# EasyEDA schematic SCH_OpenRICE.json
TITLE: CH32X033F8P6; REV: 1.0; Date: 2026-05-31; Sheet: 1/1; Drawn By: Saandeep; Company: Vishishta Innovators
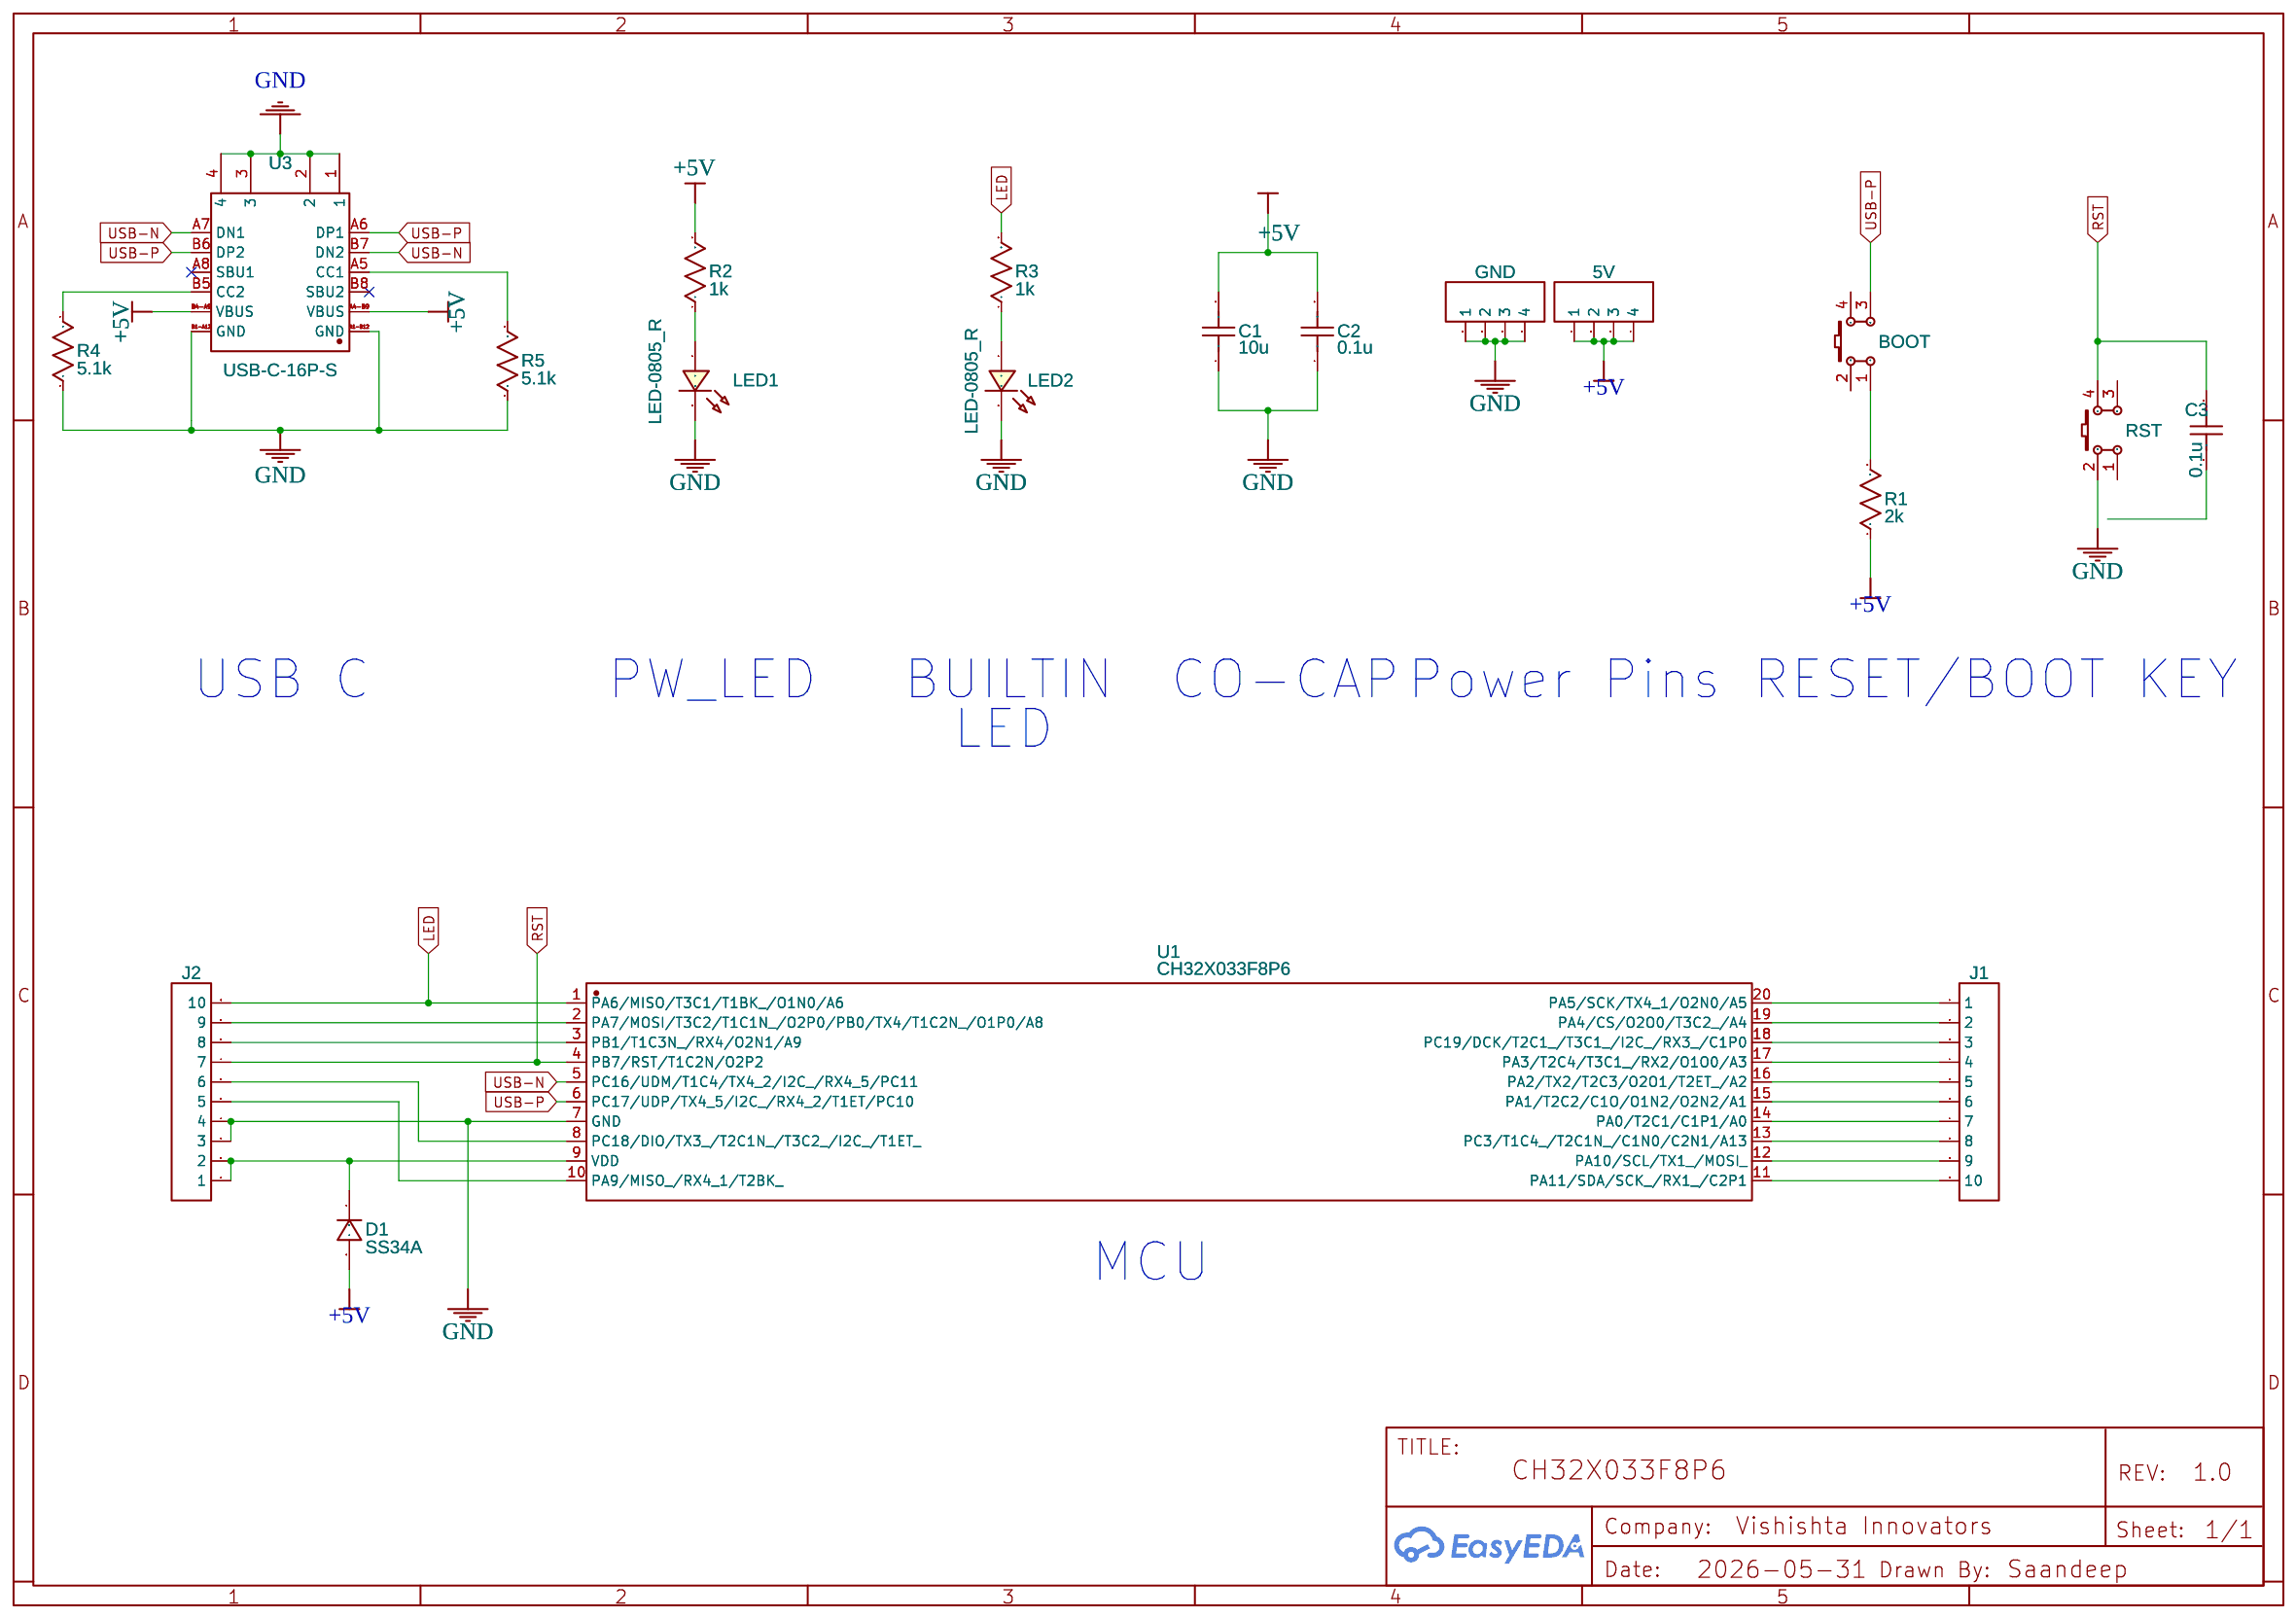
[diagram p0: schematic sheet]

## Parts
5V  HDR-M-2.54_1x4  [HDR-M-2.54_1X4]
BOOT  K4-6×6_TH  [KEY-TH_4P-L6.0-W6.0-P4.50-LS6.5]
C1  10u  [C0805]
C2  0.1u  [C0805]
C3  0.1u  [C0805]
D1  SS34A  [SMA_L4.3-W2.6-LS5.2-RD]
GND  HDR-M-2.54_1x4  [HDR-M-2.54_1X4]
J1  HDR-M-2.54_1x10  [HDR-M-2.54_1X10]
J2  HDR-M-2.54_1x10  [HDR-M-2.54_1X10]
LED1  LED-0805_R  [LED0805_RED]
LED2  LED-0805_R  [LED0805_RED]
R1  2k  [R0805]
R2  1k  [R0805]
R3  1k  [R0805]
R4  5.1k  [R0805]
R5  5.1k  [R0805]
RST  K4-6×6_TH  [KEY-TH_4P-L6.0-W6.0-P4.50-LS6.5]
U1  CH32X033F8P6  [TSSOP-20_L6.5-W4.4-P0.65-LS6.4-BL]
U3  USB-C-16P-S  [USB-C-16P-S]

## Library data of the parts
5V GND = HDR-M-2.54_1x4: Supplier Part: C124378; Supplier: LCSC; Contributor: LCEDA_Lib
BOOT RST = K4-6×6_TH: Supplier: LCSC; Supplier Part: C136684; Manufacturer: 韩国韩荣; Manufacturer Part: K2-1102DP-E4SW-04; Contributor: LCEDA_Lib
C1-C3 = C_0805_US: Contributor: LCEDA_Lib
D1 = SS34A: Contributor: LCSC; Supplier: LCSC; Supplier Part: C211775; Manufacturer: YANGJIE(扬杰); JLCPCB Part Class: Extended Part
J1 J2 = HDR-M-2.54_1x10: Supplier Part: C57369; Supplier: LCSC; Contributor: LCEDA_Lib
LED1 LED2 = LED-0805_R: Manufacturer: EVERLIGHT(台湾亿光); Manufacturer Part: 17-21SURC/S530-A3/TR8; Supplier Part: C72037; Contributor: LCEDA_Lib
R1-R5 = R_0805_US: Contributor: LCEDA_Lib
U1 = CH32X033F8P6: Supplier: LCSC; Supplier Part: C19268290; Manufacturer: WCH(南京沁恒); JLCPCB Part Class: Extended Part
U3 = USB-C-16P-S: Supplier: LCSC; Supplier Part: C9900000831; Manufacturer: null; JLCPCB Part Class: Extended Part; Contributor: LCSC

## Nets
+5V: 5V.1 5V.2 5V.3 5V.4 C1.2 C2.2 D1.2(A) R1.1 R2.2 U3.A4-B9(VBUS) U3.B4-A9(VBUS)
GND: C1.1 C2.1 GND.1 GND.2 GND.3 GND.4 J2.3 J2.4 LED1.2 LED2.2 R4.1 R5.1 RST.2 U1.7(GND) U3.1 U3.2 U3.3 U3.4 U3.A1-B12(GND) U3.B1-A12(GND)
LED: J2.10 R3.2 U1.1(PA6/MISO/T3C1/T1BK_/O1N0/A6)
RST: C3.2 J2.7 RST.4 U1.4(PB7/RST/T1C2N/O2P2)
USB-N: U1.5(PC16/UDM/T1C4/TX4_2/I2C_/RX4_5/PC11) U3.A7(DN1) U3.B7(DN2)
USB-P: BOOT.3 U1.6(PC17/UDP/TX4_5/I2C_/RX4_2/T1ET/PC10) U3.A6(DP1) U3.B6(DP2)
Net-(BOOT-1): BOOT.1 R1.2
Net-(D1-1): D1.1(C) J2.1 J2.2 U1.9(VDD)
Net-(J1-1): J1.1 U1.20(PA5/SCK/TX4_1/O2N0/A5)
Net-(J1-2): J1.2 U1.19(PA4/CS/O2O0/T3C2_/A4)
Net-(J1-3): J1.3 U1.18(PC19/DCK/T2C1_/T3C1_/I2C_/RX3_/C1P0)
Net-(J1-4): J1.4 U1.17(PA3/T2C4/T3C1_/RX2/O1O0/A3)
Net-(J1-5): J1.5 U1.16(PA2/TX2/T2C3/O2O1/T2ET_/A2)
Net-(J1-6): J1.6 U1.15(PA1/T2C2/C1O/O1N2/O2N2/A1)
Net-(J1-7): J1.7 U1.14(PA0/T2C1/C1P1/A0)
Net-(J1-8): J1.8 U1.13(PC3/T1C4_/T2C1N_/C1N0/C2N1/A13)
Net-(J1-9): J1.9 U1.12(PA10/SCL/TX1_/MOSI_)
Net-(J1-10): J1.10 U1.11(PA11/SDA/SCK_/RX1_/C2P1)
Net-(J2-5): J2.5 U1.10(PA9/MISO_/RX4_1/T2BK_)
Net-(J2-6): J2.6 U1.8(PC18/DIO/TX3_/T2C1N_/T3C2_/I2C_/T1ET_)
Net-(J2-8): J2.8 U1.3(PB1/T1C3N_/RX4/O2N1/A9)
Net-(J2-9): J2.9 U1.2(PA7/MOSI/T3C2/T1C1N_/O2P0/PB0/TX4/T1C2N_/O1P0/A8)
Net-(LED1-1): LED1.1 R2.1
Net-(LED2-1): LED2.1 R3.1
Net-(R4-2): R4.2 U3.B5(CC2)
Net-(R5-2): R5.2 U3.A5(CC1)

Not connected (* = marked no-connect by the designer): BOOT 2 4; C3 1; RST 1 3; U3 A8(SBU1)* B8(SBU2)*

## Notes on the sheet
- USB C
- PW_LED
- BUILTIN
- CO-CAP
- Power Pins
- RESET/BOOT KEY
- LED
- MCU
